# EAGLE design Mini_USB_DMX (EAGLE 5.11)
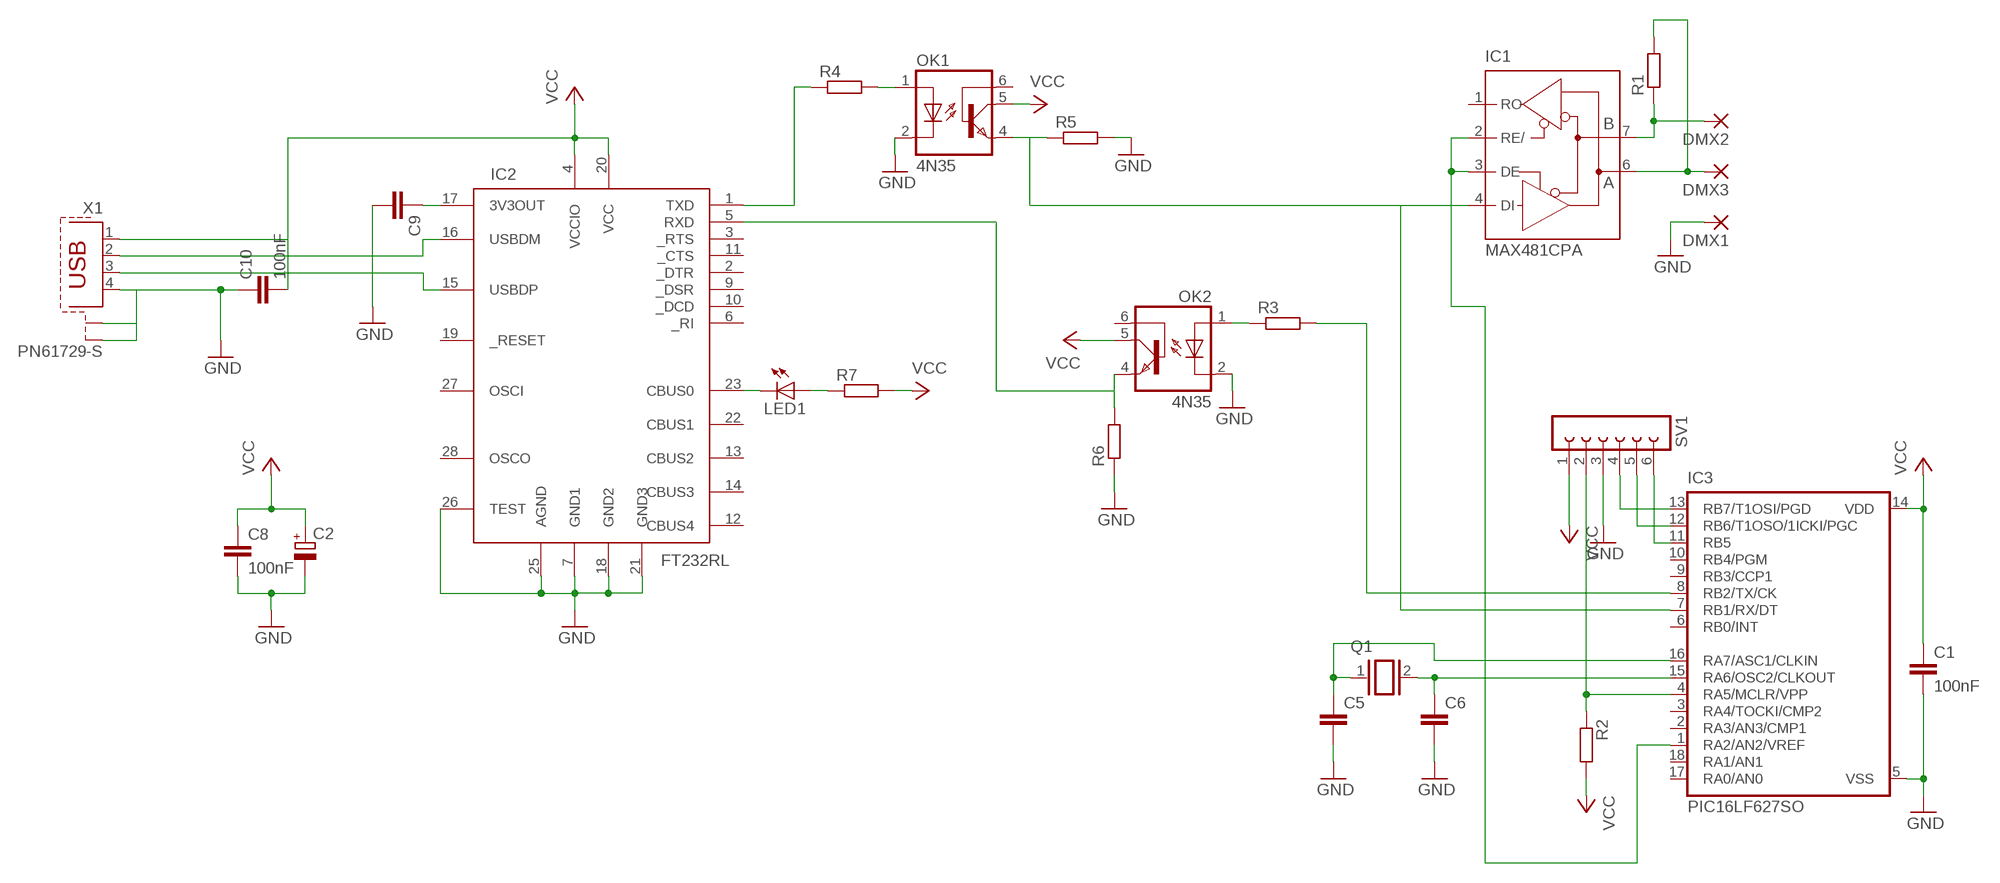
[diagram p0: schematic, sheet 1]

## Parts
C1  100nF  C-EUC1206K  [C1206K]
C2  CPOL-EUE2.5-7  [E2,5-7]
C5  C-EUC0805K  [C0805K]
C6  C-EUC0805K  [C0805K]
C8  100nF  C-EUC1206K  [C1206K]
C9  C-EUC1206K  [C1206K]
C10  100nF  C-EUC1206K  [C1206K]
DMX1  2,54/0,8  [2,54/0,8]
DMX2  2,54/0,8  [2,54/0,8]
DMX3  2,54/0,8  [2,54/0,8]
IC1  MAX481CPA  [DIL08]
IC2  FT232RL  [SSOP28DB]
IC3  PIC16LF627SO  [SO-18W]
LED1  LEDCHIPLED_0805  [CHIPLED_0805]
OK1  4N35  [DIL06]
OK2  4N35  [DIL06]
Q1  XTAL  [Q]
R1  R-EU_M1206  [M1206]
R2  R-EU_M0805  [M0805]
R3  R-EU_R0805  [R0805]
R4  R-EU_R0805  [R0805]
R5  R-EU_R0805  [R0805]
R6  R-EU_R0805  [R0805]
R7  R-EU_M0805  [M0805]
SV1  FE06-1  [FE06]
X1  PN61729-S  [PN61729-S]

## Nets
GND: C1.2 C2.- C5.2 C6.2 C8.2 C9.2 C10.1 DMX1.1(P) IC2.7(GND1) IC2.18(GND2) IC2.21(GND3) IC2.25(AGND) IC2.26(TEST) IC3.5(VSS) OK1.2(C) OK2.2(C) R5.2 R6.1 SV1.3 X1.4 X1.S1 X1.S2
N$1: IC3.8(RB2/TX/CK) R3.2
N$2: IC3.13(RB7/T1OSI/PGD) SV1.4
N$3: IC2.23(CBUS0) LED1.C
N$4: C9.1 IC2.17(3V3OUT)
N$5: IC1.2(RE/) IC1.3(DE) IC3.1(RA2/AN2/VREF)
N$6: DMX3.1(P) IC1.6(A) R1.2
N$7: IC2.16(USBDM) X1.2
N$8: IC2.15(USBDP) X1.3
N$9: DMX2.1(P) IC1.7(B) R1.1
N$10: C6.1 IC3.15(RA6/OSC2/CLKOUT) Q1.2
N$11: C5.1 IC3.16(RA7/ASC1/CLKIN) Q1.1
N$12: IC3.4(RA5/MCLR/VPP) R2.1 SV1.2
N$13: IC3.12(RB6/T1OSO/1ICKI/PGC) SV1.5
N$14: OK2.1(A) R3.1
N$15: OK1.1(A) R4.2
N$18: IC2.1(TXD) R4.1
N$19: LED1.A R7.1
N$20: IC3.11(RB5) SV1.6
N$21: IC2.5(RXD) OK2.4(EMI) R6.2
N$22: IC1.4(DI) IC3.7(RB1/RX/DT) OK1.4(EMI) R5.1
VCC: C1.1 C2.+ C8.1 C10.2 IC2.4(VCCIO) IC2.20(VCC) IC3.14(VDD) OK1.5(COL) OK2.5(COL) R2.2 R7.2 SV1.1 X1.1
Unconnected: IC1.1(RO) IC2.2(_DTR) IC2.3(_RTS) IC2.6(_RI) IC2.9(_DSR) IC2.10(_DCD) IC2.11(_CTS) IC2.12(CBUS4) IC2.13(CBUS2) IC2.14(CBUS3) IC2.19(_RESET) IC2.22(CBUS1) IC2.27(OSCI) IC2.28(OSCO) IC3.2(RA3/AN3/CMP1) IC3.3(RA4/TOCKI/CMP2) IC3.6(RB0/INT) IC3.9(RB3/CCP1) IC3.10(RB4/PGM) IC3.17(RA0/AN0) IC3.18(RA1/AN1) OK1.6(BAS) OK2.6(BAS)

## Notes on the sheet
- FT232RL

## Power pins joined to a net without a drawn wire
GND: IC1.5(GND)
VCC: IC1.8(VCC)

## Library data of the parts
C1 C5 C6 C8-C10 = resistor:C-EU: CAPACITOR, European symbol
C2 = resistor:CPOL-EU: POLARIZED CAPACITOR, European symbol
DMX1-DMX3 = wirepad:2,54/0,8: THROUGH-HOLE PAD
IC1 = maxim:MAX481CPA: RS485 TRANSEIVER; MPN: MAX481CPA+; OC_FARNELL: unknown; OC_NEWARK: 99K3445
IC2 = ftdichip:FT232RL: USB UART 4th Generation USB UART (USB <-> Serial) Controller
IC3 = microchip-update-2:PIC16*F62: FLASH-Based 8-Bit CMOS Microcontroller Source: http://ww1.microchip.com/downloads/en/DeviceDoc/40300C.pdf
LED1 = led:LED: LED OSRAM: - CHIPLED LG R971, LG N971, LY N971, LG Q971, LY Q971, LO R971, LY R971 LH N974, LH R974 LS Q976, LO Q976, LY Q976 LO Q996 - Hyper CHIPLED LW Q18S LB Q993, LB Q99A, LB R99A - SideLED LS A670, LO A670, LY A670, LG A670, LP A670 LB A673, LV A673, LT A673, LW A673 LH A674 LY A675 LS A676, LA A676, LO A676, LY A676, LW A676 LS A679, LY A679, LG A679 - Hyper Micro SIDELED® LS Y876, LA Y876, LO Y876, LY Y876 LT Y87S - SmartLED LW L88C, LW L88S LB L89C, LB L89S, LG L890 LS L89K, LO L89K, LY L89K LS L896, LA L896, LO L896, LY L896 - TOPLED LS T670, LO T670, LY T670, LG T670, LP T670 LSG T670, LSP T670, LSY T670, LOP T670, LYG T670 LG T671, LOG T671, LSG T671 LB T673, LV T673, LT T673, LW T673 LH T674 LS T676, LA T676, LO T676, LY T676, LB T676, LH T676, LSB T676, LW T676 LB T67C, LV T67C, LT T67C, LS T67K, LO T67K, LY T67K, LW E67C LS E67B, LA E67B, LO E67B, LY E67B, LB E67C, LV E67C, LT E67C LW T67C LS T679, LY T679, LG T679 LS T770, LO T770, LY T770, LG T770, LP T770 LB T773, LV T773, LT T773, LW T773 LH T774 LS E675, LA E675, LY E675, LS T675 LS T776, LA T776, LO T776, LY T776, LB T776 LHGB T686 LT T68C, LB T68C - Hyper Mini TOPLED® LB M676 - Mini TOPLED Santana® LG M470 LS M47K, LO M47K, LY M47K Source: http://www.osram.convergy.de LUXEON: - LUMILED® LXK2-PW12-R00, LXK2-PW12-S00, LXK2-PW14-U00, LXK2-PW14-V00 LXK2-PM12-R00, LXK2-PM12-S00, LXK2-PM14-U00 LXK2-PE12-Q00, LXK2-PE12-R00, LXK2-PE12-S00, LXK2-PE14-T00, LXK2-PE14-U00 LXK2-PB12-K00, LXK2-PB12-L00, LXK2-PB12-M00, LXK2-PB14-N00, LXK2-PB14-P00, LXK2-PB14-Q00 LXK2-PR12-L00, LXK2-PR12-M00, LXK2-PR14-Q00, LXK2-PR14-R00 LXK2-PD12-Q00, LXK2-PD12-R00, LXK2-PD12-S00 LXK2-PH12-R00, LXK2-PH12-S00 LXK2-PL12-P00, LXK2-PL12-Q00, LXK2-PL12-R00 Source: www.luxeon.com KINGBRIGHT: KA-3528ASYC Source: www.kingbright.com
OK1 OK2 = optocoupler:4N35: MOTOROLA OPTO COUPLER; MF: FAIRCHILD SEMICONDUCTOR; MPN: 4N35; OC_FARNELL: 1328375; OC_NEWARK: 72K9946
Q1 = special:XTAL: CRYSTAL
R1-R7 = resistor:R-EU_: RESISTOR, European symbol
SV1 = con-lsta:FE06-1: FEMALE HEADER; OC_FARNELL: unknown; OC_NEWARK: unknown
X1 = con-berg:PN61729-S: BERG USB connector; OC_FARNELL: unknown; OC_NEWARK: unknown

## Board
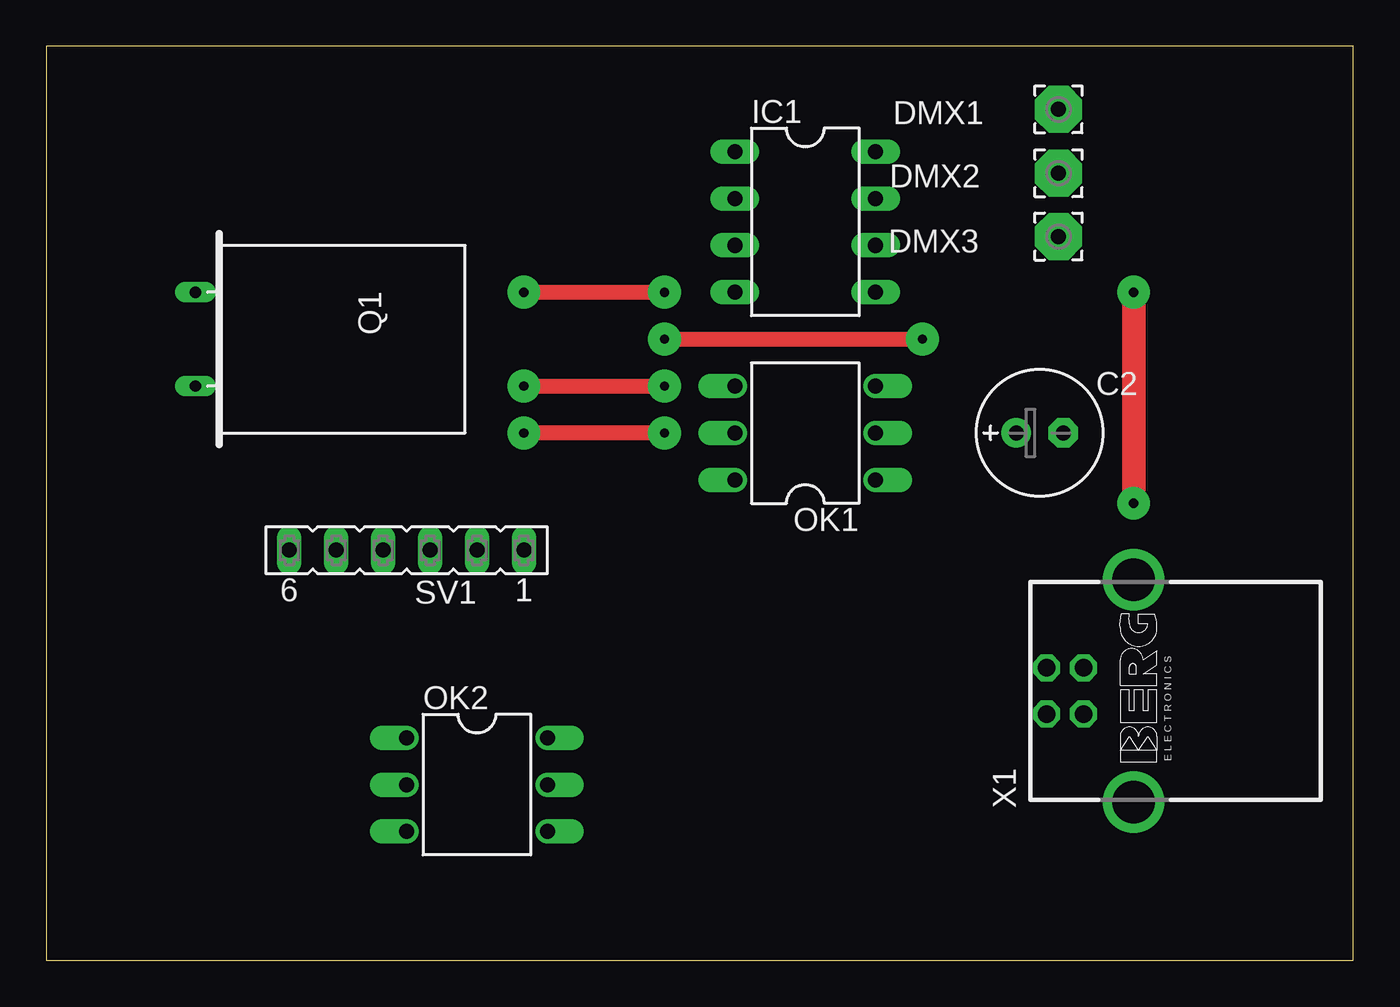
[diagram p1: board, top side]
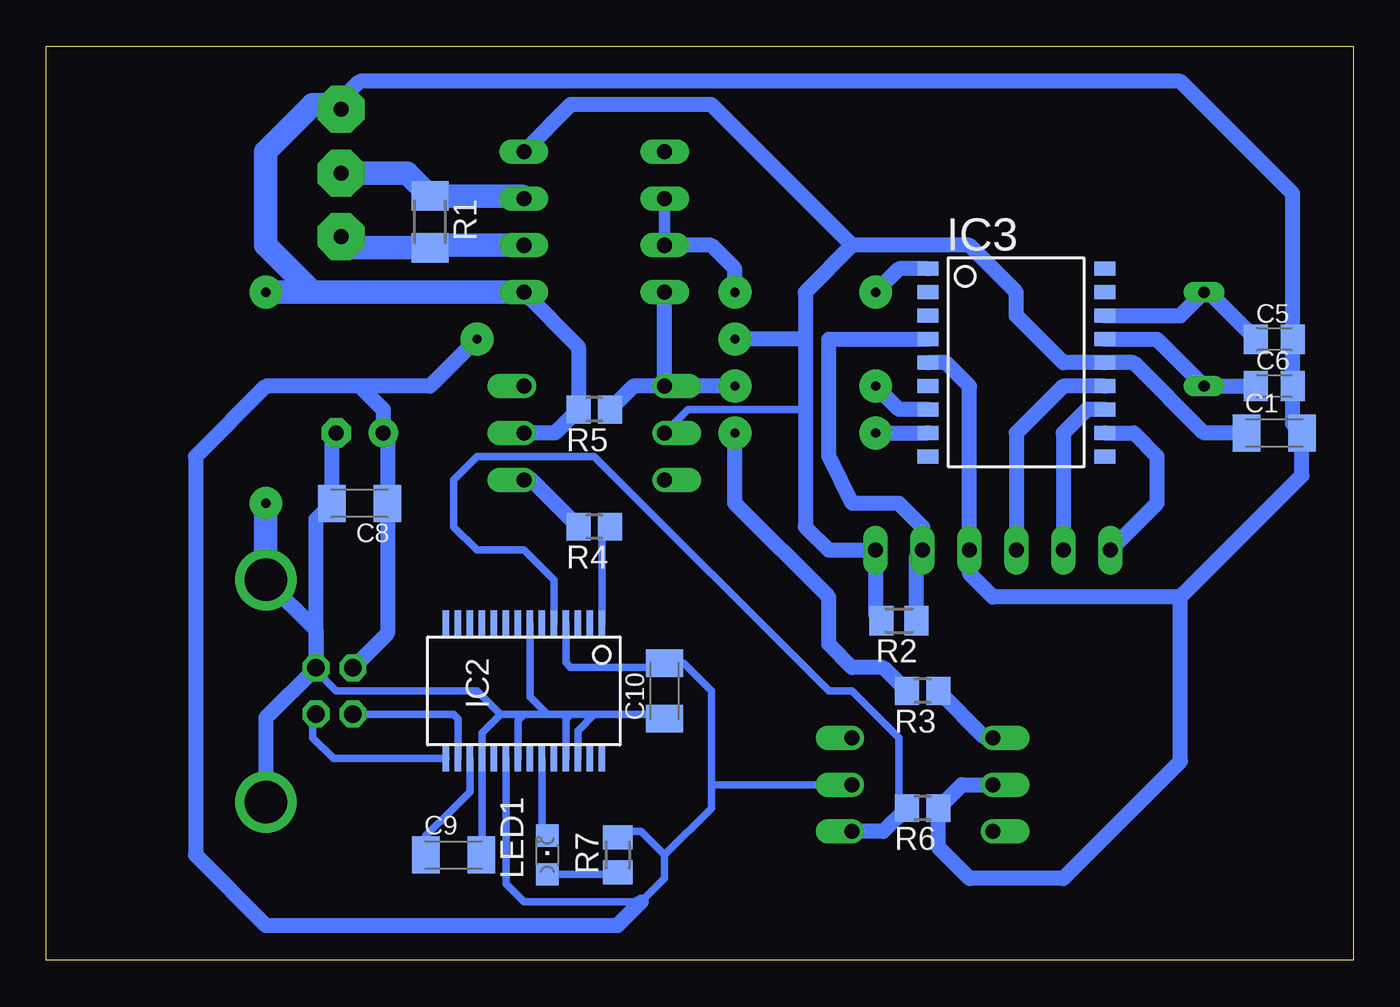
[diagram p2: board, bottom side, seen from below]

Size 70.79 x 49.52 mm. Coordinates in mm from the lower left corner, seen from the top.
Outline: 0,0 70.79,0 70.79,49.52 0,49.52 0,0
Copper layers (1*16): Top 0.035mm / dielectric 1.5mm / Bottom 0.035mm
Design rules "default": minimum track width 10mil, minimum drill 24mil, track to track 8mil, track to pad 8mil, pad to pad 8mil, via to via 8mil, smd to smd 8mil, copper to edge 40mil, drill to drill 8mil, minimum pad ring 10mil, minimum via ring 8mil, stop-mask expansion 4mil, vias tented up to drill 0mil, thermal gap 10mil
tRestrict: area 27.6,40.4 to 29.3,49.5; area 23.8,48 to 25.3,51.4; area 24.3,47.3 to 25.2,48.7; area 35.9,45.3 to 38.3,49.4; area 28.9,32.3 to 30.4,37.2; area 34.9,33.6 to 37.7,36.5; area 22.6,37.8 to 24.1,39.1

### Footprints (pad centres in the part's own frame; a part is rotated, then mirrored left to right if it is on the bottom)
C1206K = smd 1.5 x 2: 1 -1.5,0; 2 1.5,0
E2,5-7 = drill 0.813 pad 1.6 round: + -1.27,0 | drill 0.813 pad 1.6 octagon: - 1.27,0
C0805K = smd 1.3 x 1.6: 1 -1,0; 2 1,0
2,54/0,8 = drill 0.813 pad 2.54 octagon: 1 0,0
DIL08 = drill 0.813 long: 1 -3.81,-3.81; 2 -1.27,-3.81; 3 1.27,-3.81; 4 3.81,-3.81; 5 3.81,3.81; 6 1.27,3.81; 7 -1.27,3.81; 8 -3.81,3.81
SSOP28DB = smd 0.348 x 1.397: 1 -4.225,-3.656; 2 -3.575,-3.656; 3 -2.925,-3.656; 4 -2.275,-3.656; 5 -1.625,-3.656; 6 -0.975,-3.656; 7 -0.325,-3.656; 8 0.325,-3.656; 9 0.975,-3.656; 10 1.625,-3.656; 11 2.275,-3.656; 12 2.925,-3.656; 13 3.575,-3.656; 14 4.225,-3.656; 15 4.225,3.656; 16 3.575,3.656; 17 2.925,3.656; 18 2.275,3.656; 19 1.625,3.656; 20 0.975,3.656; 21 0.325,3.656; 22 -0.325,3.656; 23 -0.975,3.656; 24 -1.625,3.656; 25 -2.275,3.656; 26 -2.925,3.656; 27 -3.575,3.656; 28 -4.225,3.656
SO-18W = smd 0.762 x 1.143: 1 -5.08,-4.788; 2 -3.81,-4.788; 3 -2.54,-4.788; 4 -1.27,-4.788; 5 0,-4.788; 6 1.27,-4.788; 7 2.54,-4.788; 8 3.81,-4.788; 9 5.08,-4.788; 10 5.08,4.788; 11 3.81,4.788; 12 2.54,4.788; 13 1.27,4.788; 14 0,4.788; 15 -1.27,4.788; 16 -2.54,4.788; 17 -3.81,4.788; 18 -5.08,4.788
CHIPLED_0805 = smd 1.2 x 1.2: A 0,-1.05; C 0,1.05
DIL06 = drill 0.813 offset: 1 -2.54,-3.81; 2 0,-3.81; 3 2.54,-3.81; 4 2.54,3.81; 5 0,3.81; 6 -2.54,3.81
Q = drill 0.61 long: 1 -2.54,-7.62; 2 2.54,-7.62
M1206 = smd 1.6 x 2: 1 -1.4,0; 2 1.4,0
M0805 = smd 1.3 x 1.6: 1 -0.95,0; 2 0.95,0
R0805 = smd 1.3 x 1.5: 1 -0.85,0; 2 0.85,0
FE06 = drill 0.813 long: 1 -6.35,0; 2 -3.81,0; 3 -1.27,0; 4 1.27,0; 5 3.81,0; 6 6.35,0
PN61729-S = drill 0.95 octagon: 1 1.25,4.71; 2 -1.25,4.71; 3 -1.25,2.71; 4 1.25,2.71 | drill 2.3 pad 2.9 round: S1 -6.02,0; S2 6.02,0

### Placement (x,y rotation side)
C1  4.28,28.57 0 bottom
C2  53.81,28.57 0 top
C5  4.28,33.65 0 bottom
C6  4.28,31.11 0 bottom
C8  53.81,24.76 180 bottom
C9  48.73,5.71 0 bottom
C10  37.3,14.6 90 bottom
DMX1  54.83,46.1 180 top
DMX2  54.83,42.64 180 top
DMX3  54.83,39.21 180 top
IC1  41.11,40 270 top
IC2  44.92,14.6 180 bottom
IC3  18.25,32.38 270 bottom
LED1  43.65,5.71 0 bottom
OK1  41.11,28.57 90 top
OK2  23.33,9.52 270 top
Q1  15.71,33.65 270 top
R1  50,40 270 bottom
R2  24.6,18.41 180 bottom
R3  23.33,14.6 180 bottom
R4  41.11,23.49 180 bottom
R5  41.11,29.84 180 bottom
R6  23.33,8.25 180 bottom
R7  39.84,5.71 90 bottom
SV1  19.52,22.22 180 top
X1  58.89,14.6 90 top

### Tracks (layer width: path | path; a pad name or v marks a point on that pad's centre or on a via)
GND  (via drill 0.5 pad 1.78)
  Top 1.27: v58.89,36.19 v58.89,24.76
  Bottom 0.406: 46.19,13.33 47.2,12.32 IC2.18 47.2,5.75 C9.2 | 46.19,13.33 44.92,13.33 | 44.92,13.33 43.65,13.33 | 43.65,13.33 42.38,13.33 | 42.38,13.33 41.11,13.33 | 41.11,13.33 37.53,13.33 C10.1 | IC2.26 42,12.45 41.11,13.33 | IC2.25 42.65,13.06 42.38,13.33 | IC2.21 45.25,13 44.92,13.33 | IC2.7 44.6,14.27 43.65,13.33 | X1.4 56.18,15.7 55.08,14.6 47.46,14.6 46.19,13.33
  Bottom 0.813: IC3.5 22.06,32.38 20.79,31.11 SV1.3 20.79,20.95 19.52,19.68 9.36,19.68 | C1.2 3.28,29.07 | C1.2 2.78,26.26 9.36,19.68 | OK1.2 43.23,28.57 R5.2 41.96,33.23 IC1.5 | X1.4 56.18,17.91 X1.S2 | X1.4 56.18,23.89 C8.2 55.31,28.34 C2.- | X1.S1 58.89,13.14 X1.4 | OK2.2 21.21,9.52 R6.1 22.48,6.13 20.79,4.44 15.71,4.44 9.36,10.79 9.36,19.68 | 55.08,46.35 53.81,47.62 9.36,47.62 3.28,41.54 C5.2 C6.2 3.28,29.07 | C1.2 3.28,29.07
  Bottom 1.27: 56.35,36.19 IC1.5 | 56.35,36.19 58.89,38.73 58.89,43.81 56.35,46.35 55.08,46.35 DMX1.1 | 56.35,36.19 v58.89,36.19 | v58.89,24.76 X1.S2
N$1  (via drill 0.5 pad 1.78)
  Top 0.813: v33.49,28.57 v25.87,28.57
  Bottom 0.813: v25.87,28.57 IC3.8 | v33.49,28.57 33.49,24.76 28.41,19.68 28.41,17.14 27.14,15.87 25.45,15.87 R3.2
N$2
  Bottom 0.813: IC3.13 15.71,31.11 18.25,28.57 SV1.4
N$3
  Bottom 0.406: IC2.23 43.95,7.06 LED1.C
N$4
  Bottom 0.406: IC2.17 47.85,9.13 48.73,8.25 50.23,6.75 C9.1
N$5  (via drill 0.5 pad 1.78)
  Top 0.813: v25.87,36.19 v33.49,36.19
  Bottom 0.61: IC1.3 IC1.2
  Bottom 0.813: IC3.1 24.6,37.46 v25.87,36.19 | v33.49,36.19 33.49,37.46 34.76,38.73 IC1.3
N$6
  Bottom 1.27: IC1.6 49.87,38.73 R1.2 54.22,38.6 DMX3.1
N$7
  Bottom 0.406: IC2.16 48.5,13.09 48.73,13.33 54.16,13.33 X1.2
N$8
  Bottom 0.406: IC2.15 55.23,10.94 56.35,12.06 56.35,13.18 X1.3
N$9
  Bottom 1.27: DMX2.1 51.23,42.63 R1.1 45.05,41.4 IC1.7
N$10
  Bottom 0.813: IC3.15 10.63,33.65 Q1.2 C6.1
N$11
  Bottom 0.813: IC3.16 9.36,34.92 Q1.1 7.82,36.19 C5.1
N$12
  Bottom 0.813: R2.1 23.65,21.9 SV1.2 23.33,23.49 24.6,24.76 27.14,24.76 28.41,27.3 28.41,33.65 27.14,33.65 IC3.4
N$13
  Bottom 0.813: IC3.12 14.44,29.84 15.71,28.57 SV1.5
N$14
  Bottom 0.813: OK2.1 19.94,12.06 R3.1
N$15
  Bottom 0.813: OK1.1 44.5,26.03 R4.2
N$18
  Bottom 0.406: IC2.1 40.7,23.05 R4.1
N$19
  Bottom 0.406: LED1.A 39.94,4.66 R7.1
N$20
  Bottom 0.813: IC3.11 11.9,28.57 10.63,27.3 10.63,24.76 SV1.6
N$21
  Bottom 0.406: IC2.5 43.3,20.59 44.92,22.22 47.46,22.22 48.73,23.49 48.73,26.03 47.46,27.3 41.11,27.3 28.41,14.6 27.14,14.6 24.6,12.06 24.6,8.67 R6.2
  Bottom 0.813: OK2.4 25.45,6.98 R6.2
N$22  (via drill 0.5 pad 1.78)
  Top 0.813: v25.87,31.11 v33.49,31.11
  Bottom 0.813: OK1.4 38.99,31.11 R5.1 | OK1.4 IC1.4 | IC3.7 24.6,29.84 v25.87,31.11 | v33.49,31.11 OK1.4
VCC  (via drill 0.5 pad 1.78)
  Top 0.813: v33.49,33.65 v47.46,33.65
  Bottom 0.406: IC2.20 45.9,4.15 44.92,3.17 38.57,3.17 37.3,4.44 37.3,5.71 | 37.3,5.71 38.57,6.98 39.52,6.98 R7.2 | 34.76,9.52 34.76,8.25 37.3,5.71 | 34.76,9.52 34.76,14.6 36.26,16.1 C10.2 37.53,15.87 42.38,15.87 42.65,16.13 IC2.4 | OK1.5 36.03,29.84 29.68,29.84 | 34.76,9.52 OK2.5
  Bottom 0.813: C1.1 8.09,28.57 11.9,32.38 IC3.14 15.71,32.38 18.25,34.92 18.25,36.19 20.79,38.73 27.14,38.73 | 29.68,33.65 29.68,36.19 27.14,38.73 | 29.68,33.65 29.68,29.84 29.68,23.49 28.41,22.22 SV1.1 25.87,18.73 R2.2 | X1.1 52.31,17.72 C8.1 52.31,28.34 C2.+ 52.54,29.84 53.81,31.11 | 53.81,31.11 58.89,31.11 62.7,27.3 62.7,5.71 58.89,1.9 39.84,1.9 38.57,3.17 | 53.81,31.11 50,31.11 v47.46,33.65 | 29.68,33.65 v33.49,33.65 | IC1.8 42.38,46.35 34.76,46.35 27.14,38.73